# EAGLE design NMX-202 (EAGLE 8.4.3)
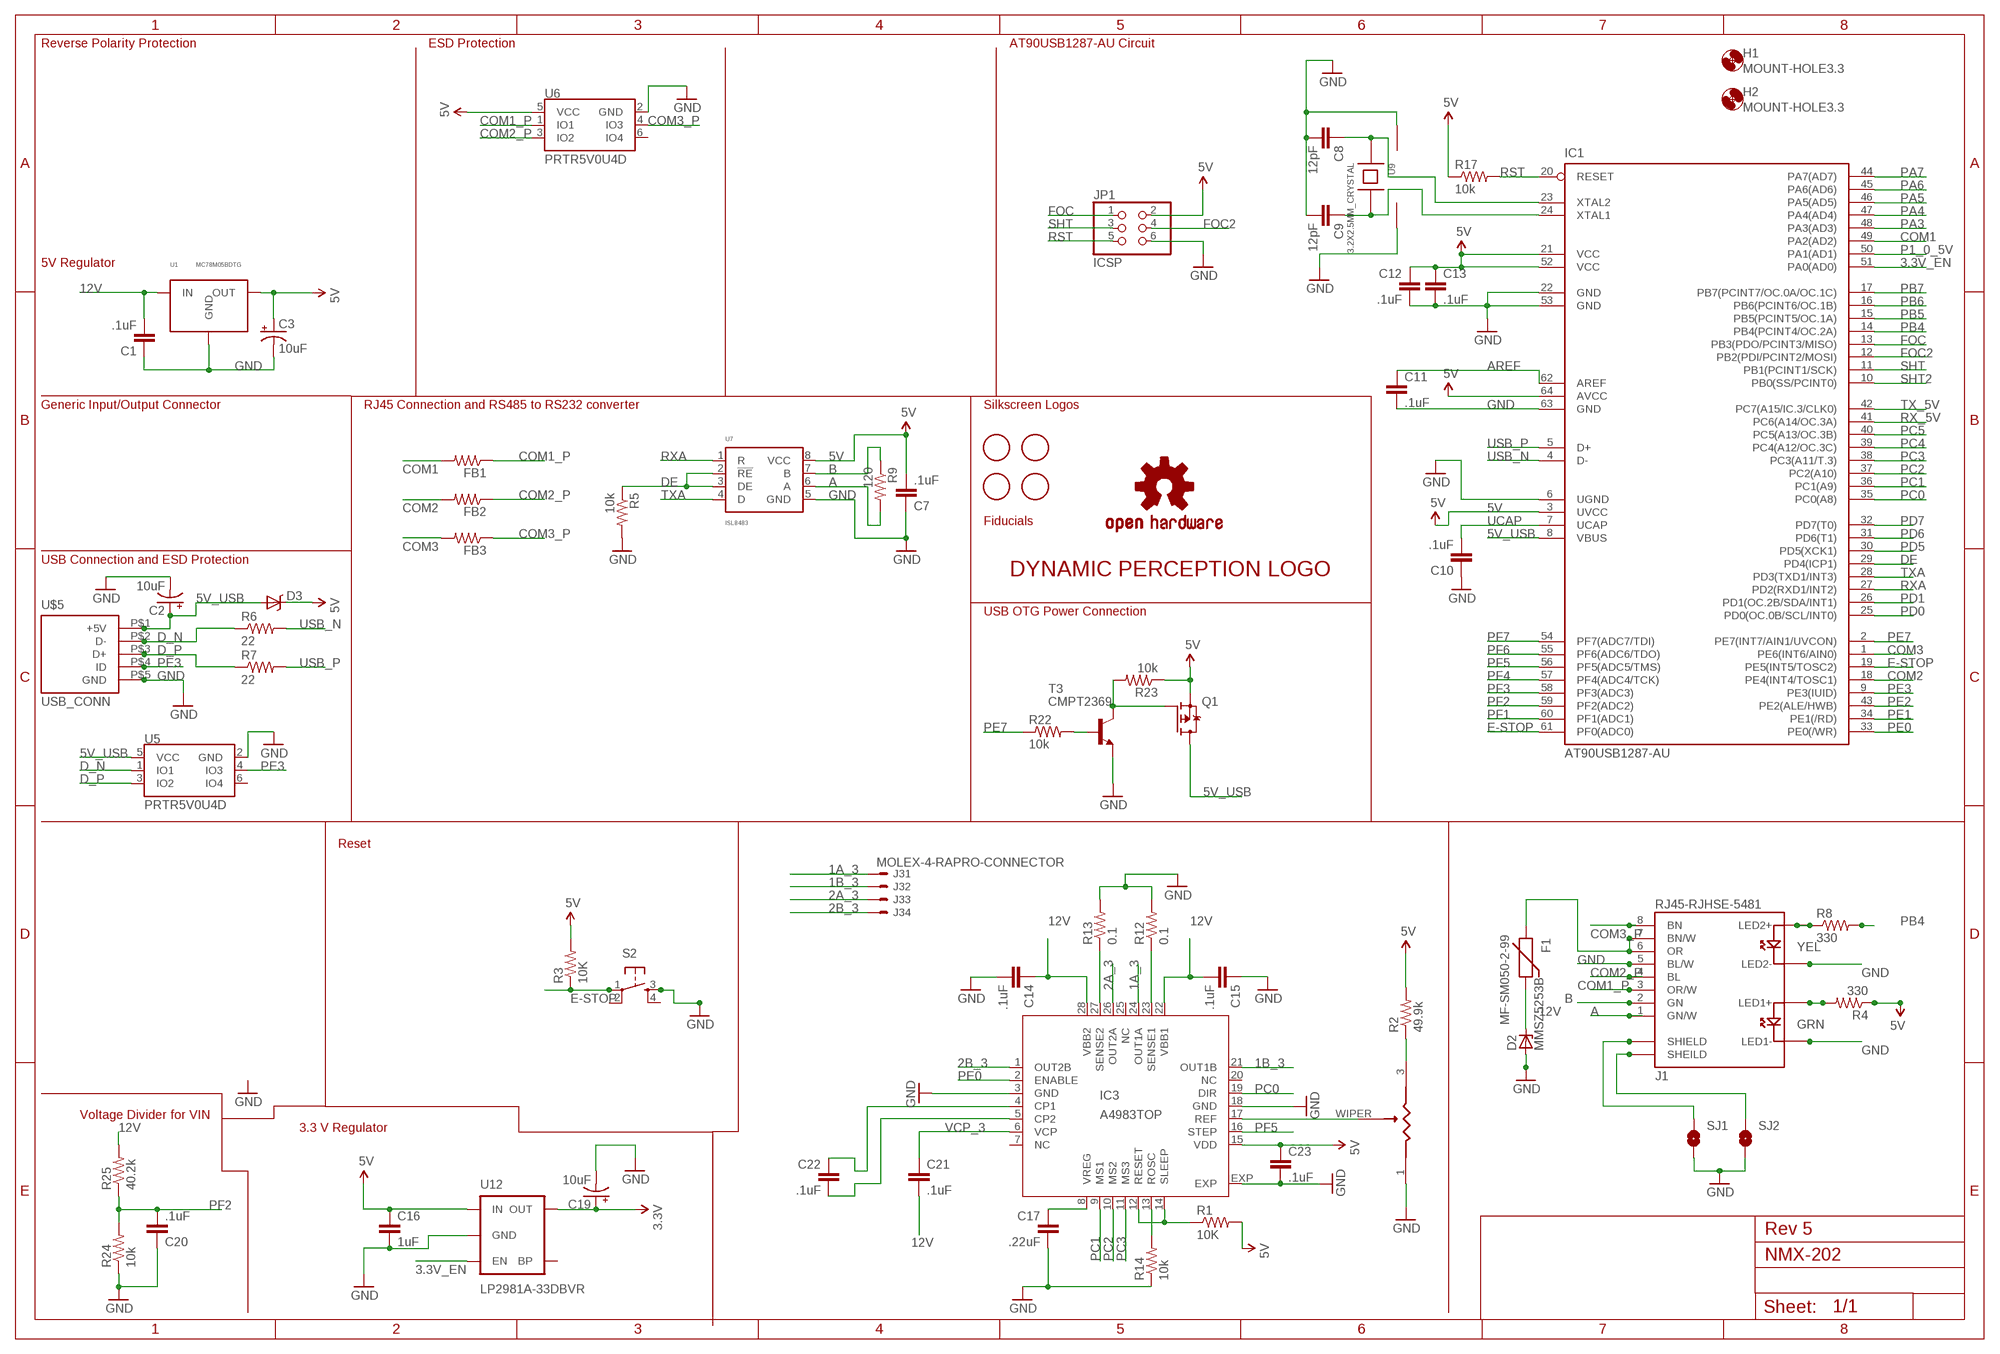
[diagram p0: schematic, sheet 1]

## Parts
C1  .1uF  CAP0402-CAP  [0402-CAP]
C2  10uF  CAP_POL1206  [EIA3216]
C3  10uF  CAP_POL1206  [EIA3216]
C7  .1uF  CAP0402-CAP  [0402-CAP]
C8  12pF  CAP0402-CAP  [0402-CAP]
C9  12pF  CAP0402-CAP  [0402-CAP]
C10  .1uF  CAP0402-CAP  [0402-CAP]
C11  .1uF  CAP0402-CAP  [0402-CAP]
C12  .1uF  CAP0402-CAP  [0402-CAP]
C13  .1uF  CAP0402-CAP  [0402-CAP]
C14  .1uF  CAP0402-CAP  [0402-CAP]
C15  .1uF  CAP0402-CAP  [0402-CAP]
C16  1uF  CAP0402-CAP  [0402-CAP]
C17  .22uF  CAP0402-CAP  [0402-CAP]
C19  10uF  CAP_POL1206  [EIA3216]
C20  .1uF  CAP0402-CAP  [0402-CAP]
C21  .1uF  CAP0402-CAP  [0402-CAP]
C22  .1uF  CAP0402-CAP  [0402-CAP]
C23  .1uF  CAP0402-CAP  [0402-CAP]
D2  MMSZ5253B  ZENER-DIODESOD123  [SOD123]
D3  DIODE-SCHOTTKY-BAT20J  [SOD-323]
F1  MF-SM050-2-99  PTC2920  [PTC-2920]
FB1  HZ0402B102R-10  R-US_R0402  [R0402]
FB2  HZ0402B102R-10  R-US_R0402  [R0402]
FB3  HZ0402B102R-10  R-US_R0402  [R0402]
FRAME2  A3L-LOCSILK_SCREEN  [DRAWING_NAME]
H1  MOUNT-HOLE3.3  [3,3]
H2  MOUNT-HOLE3.3  [3,3]
IC1  AT90USB1287-AU  [TQFP64]
IC3  A4983TOP  [QFN28ET]
J1  RJ45-RJHSE-5481  [RJ45-RJHSE]
J3  MOLEX-4-RAPRO-CONNECTOR  [PRO_CONNECTOR]
JP1  ICSP  PINHD-2X3  [2X03]
Q1  P-CHANNEL_MOSFET  [SOT23-3]
R1  10K  R-US_R0402_B  [R0402_BOTTOM]
R2  49.9k  R-US_R0402_B  [R0402_BOTTOM]
R3  10K  R-US_R0402_B  [R0402_BOTTOM]
R4  330  R-US_R0402  [R0402]
R5  10k  R-US_R0402  [R0402]
R6  22  R-US_R0402  [R0402]
R7  22  R-US_R0402  [R0402]
R8  330  R-US_R0402  [R0402]
R9  120  R-US_R0402  [R0402]
R12  0.1  R-US_R0603  [R0603]
R13  0.1  R-US_R0603  [R0603]
R14  10k  R-US_R0402_B  [R0402_BOTTOM]
R17  10k  R-US_R0402  [R0402]
R22  10k  R-US_R0402  [R0402]
R23  10k  R-US_R0402  [R0402]
R24  10k  R-US_R0402  [R0402]
R25  40.2k  R-US_R0402  [R0402]
S2  TAC_SWITCH  [TACTICLE_SWITCH_SMD_EVQP0_BOT]
SJ1  SJ_1WAY  [SJ_2]
SJ2  SJ_1WAY  [SJ_2]
T3  CMPT2369  BCW60-NPN-SOT23-BEC  [SOT23-BEC]
U1  MC78M05BDTG  VOLTAGE_REG  [DPAK-3]
U5  PRTR5V0U4D  [SOT23-6]
U6  PRTR5V0U4D  [SOT23-6]
U7  ISL8483  SN65176D  [SO-08]
U9  3.2X2.5MM_CRYSTAL  [3.2X2.5MM]
U11  CADJ  TC33X-2  [3MM_SMD]
U12  LP2981A-33DBVR  V_REG_LDOSMD  [SOT23-5]
U$1  DP_LOGOMICRO  [DP_LOGO_MICRO]
U$2  OSHW-LOGOS  [OSHW-LOGO-S]
U$3  FIDUCIAL  [FIDUCIAL_1MM]
U$4  FIDUCIAL  [FIDUCIAL_1MM]
U$5  USB_CONN  [10118194-0001LF]
U$6  FIDUCIAL  [FIDUCIAL_1MM]
U$7  FIDUCIAL  [FIDUCIAL_1MM]

## Nets
1A_3 [StepperPower]: IC3.24(OUT1A) J3.P$1
1B_3 [StepperPower]: IC3.21(OUT1B) J3.P$2
2A_3 [StepperPower]: IC3.26(OUT2A) J3.P$3
2B_3 [StepperPower]: IC3.1(OUT2B) J3.P$4
3.3V: C19.A(+) U12.5(OUT)
3.3V_EN: IC1.51(PA0(AD0)) U12.3(EN)
5V [vccControllers]: C3.A(+) C7.2 C12.1 C13.1 C16.1 C23.1 D3.C IC1.3(UVCC) IC1.21(VCC) IC1.52(VCC) IC1.64(AVCC) IC3.15(VDD) JP1.2 Q1.S R1.2 R2.2 R3.2 R4.1 R17.1 R23.1 U1.2(OUT) U6.5(VCC) U7.8(VCC) U12.1(IN)
5V_USB [vccControllers]: C2.A(+) D3.A IC1.8(VBUS) Q1.D U5.5(VCC) U$5.P$1(+5V)
12V [vccControllers]: C1.2 C14.1 C15.2 C21.2 D2.C F1.P$2 IC3.22(VBB1) IC3.28(VBB2) R25.2 U1.1(IN)
A: J1.1(GN/W) R9.2 U7.6(A)
AREF: C11.1 IC1.62(AREF)
ARST3: IC3.12(RESET) IC3.14(SLEEP) R1.1
B: J1.2(GN) R9.1 U7.7(B)
COM1: FB1.2 IC1.49(PA2(AD2))
COM1_P: FB1.1 J1.3(OR/W) U6.1(IO1)
COM2: FB2.2 IC1.18(PE4(INT4/TOSC1))
COM2_P: FB2.1 J1.4(BL) U6.3(IO2)
COM3: FB3.2 IC1.1(PE6(INT6/AIN0))
COM3_P: FB3.1 J1.8(BN) U6.4(IO3)
D_N: R6.1 U5.1(IO1) U$5.P$2(D-)
D_P: R7.1 U5.3(IO2) U$5.P$3(D+)
DE: IC1.29(PD4(ICP1)) R5.1 U7.2(!RE) U7.3(DE)
E-STOP: IC1.19(PE5(INT5/TOSC2)) IC1.61(PF0(ADC0)) R3.1 S2.1
FOC: IC1.13(PB3(PDO/PCINT3/MISO)) JP1.1
FOC2: IC1.12(PB2(PDI/PCINT2/MOSI)) JP1.4
GND [gnd]: C1.1 C2.C(-) C3.C(-) C7.1 C8.2 C9.2 C10.1 C11.2 C12.2 C13.2 C14.2 C15.1 C16.2 C17.2 C19.C(-) C20.1 C23.2 D2.A IC1.6(UGND) IC1.22(GND) IC1.53(GND) IC1.63(GND) IC3.3(GND) IC3.18(GND) IC3.EXP J1.5(BL/W) J1.LE1D-(LED1-) J1.LED2- JP1.6 R5.2 R12.2 R13.2 R14.1 R24.1 S2.3 SJ1.2 SJ2.2 T3.E U1.4(GND) U5.2(GND) U6.2(GND) U7.5(GND) U9.2(GND) U9.4 U11.1 U12.2(GND) U$5.P$5(GND)
N$1 [vcc]: F1.P$1 J1.6(OR) J1.7(BN/W)
N$2: R22.2 T3.B
N$3: C22.2 IC3.5(CP2)
N$6: IC3.17(REF) U11.WIPER
N$7: C22.1 IC3.4(CP1)
N$8: J1.LED1+ R4.2
N$9 [vcc]: IC3.23(SENSE1) R12.1
N$10 [vcc]: IC3.27(SENSE2) R13.1
N$11: J1.SHIELD@0(SHIELD) SJ1.1
N$12: J1.SHEILD@1(SHEILD) SJ2.1
N$13: Q1.G R23.2 T3.C
N$14: J1.LED2+ R8.1
N$16: R2.1 U11.3
P1_0_5V: IC1.50(PA1(AD1))
PA3: IC1.48(PA3(AD3))
PA4: IC1.47(PA4(AD4))
PA5: IC1.46(PA5(AD5))
PA6: IC1.45(PA6(AD6))
PA7: IC1.44(PA7(AD7))
PB4: IC1.14(PB4(PCINT4/OC.2A)) R8.2
PB5: IC1.15(PB5(PCINT5/OC.1A))
PB6: IC1.16(PB6(PCINT6/OC.1B))
PB7: IC1.17(PB7(PCINT7/OC.0A/OC.1C))
PC0: IC1.35(PC0(A8)) IC3.19(DIR)
PC1: IC1.36(PC1(A9)) IC3.9(MS1)
PC2: IC1.37(PC2(A10)) IC3.10(MS2)
PC3: IC1.38(PC3(A11/T.3)) IC3.11(MS3)
PC4: IC1.39(PC4(A12/OC.3C))
PC5: IC1.40(PC5(A13/OC.3B))
PD0: IC1.25(PD0(OC.0B/SCL/INT0))
PD1: IC1.26(PD1(OC.2B/SDA/INT1))
PD5: IC1.30(PD5(XCK1))
PD6: IC1.31(PD6(T1))
PD7: IC1.32(PD7(T0))
PE0: IC1.33(PE0(/WR)) IC3.2(ENABLE)
PE1: IC1.34(PE1(/RD))
PE2: IC1.43(PE2(ALE/HWB))
PE3: IC1.9(PE3(IUID)) U5.4(IO3) U$5.P$4(ID)
PE7: IC1.2(PE7(INT7/AIN1/UVCON)) R22.1
PF1: IC1.60(PF1(ADC1))
PF2: C20.2 IC1.59(PF2(ADC2)) R24.2 R25.1
PF3: IC1.58(PF3(ADC3))
PF4: IC1.57(PF4(ADC4/TCK))
PF5: IC1.56(PF5(ADC5/TMS)) IC3.16(STEP)
PF6: IC1.55(PF6(ADC6/TDO))
PF7: IC1.54(PF7(ADC7/TDI))
ROSC3: IC3.13(ROSC) R14.2
RST: IC1.20(RESET) JP1.5 R17.2
RX_5V: IC1.41(PC6(A14/OC.3A))
RXA: IC1.27(PD2(RXD1/INT2)) U7.1(R)
SHT: IC1.11(PB1(PCINT1/SCK)) JP1.3
SHT2: IC1.10(PB0(SS/PCINT0))
TX_5V: IC1.42(PC7(A15/IC.3/CLK0))
TXA: IC1.28(PD3(TXD1/INT3)) U7.4(D)
UCAP: C10.2 IC1.7(UCAP)
USB_N: IC1.4(D-) R6.2
USB_P: IC1.5(D+) R7.2
VCP_3: C21.1 IC3.6(VCP)
VREG3: C17.1 IC3.8(VREG)
XTAL1: C9.1 IC1.24(XTAL1) U9.3
XTAL2: C8.1 IC1.23(XTAL2) U9.1
Unconnected: IC3.7(NC) IC3.20(NC) IC3.25(NC) S2.2 S2.4 U5.6(IO4) U6.6(IO4) U12.4(BP)

## Notes on the sheet
- Reverse Polarity Protection | ESD Protection | AT90USB1287-AU Circuit
- 5V Regulator
- Generic Input/Output Connector | RJ45 Connection and RS485 to RS232 converter | Silkscreen Logos
- Fiducials
- USB Connection and ESD Protection
- USB OTG Power Connection
- Reset
- Voltage Divider for VIN
- 3.3 V Regulator
- Rev 5

## Library data of the parts
C1 C7 C10-C15 C20-C23 = SparkFun-Capacitors:CAP: Capacitor Standard 0603 ceramic capacitor, and 0.1" leaded capacitor.; MF: Taiyo Yuden; MPN: TMK105BJ104KV-F
C2 C3 C19 = SparkFun-Capacitors:CAP_POL: Capacitor Polarized These are standard SMD and PTH capacitors. Normally 10uF, 47uF, and 100uF in electrolytic and tantalum varieties. Always verify the external diameter of the through hole cap, it varies with capacity, voltage, and manufacturer. The EIA devices should be standard.; MF: Kemet; MPN: T491A106M016AT
C8 C9 = SparkFun-Capacitors:CAP: Capacitor Standard 0603 ceramic capacitor, and 0.1" leaded capacitor.; MF: TDK Corporation; MPN: C1005C0G1H120J050BA
C16 = SparkFun-Capacitors:CAP: Capacitor Standard 0603 ceramic capacitor, and 0.1" leaded capacitor.; MF: TDK Corporation; MPN: C1005X5R1C105K050BC
C17 = SparkFun-Capacitors:CAP: Capacitor Standard 0603 ceramic capacitor, and 0.1" leaded capacitor.; MF: Taiyo Yuden; MPN: TMK105BJ224KVHF
D2 = diode:ZENER-DIODE: Z-Diode; MF: Fairchild Semiconductor; MPN: MMSZ5253B
D3 = SparkFun-DiscreteSemi:DIODE-SCHOTTKY: Schottky diodes in SFE's production catalog BAT20J 1A 23V 0.62Vf RB751 120mA 40V 0.37Vf PMEG4005EJ 0.5A 40V 0.42Vf MBRA140 1A 40V 0.5Vf B340A 3A 40V SMA; MF: NXP Semiconductors; MPN: PMEG3010BEA,115; PROD_ID: DIO-11623; VALUE: BAT20J
F1 = SparkFun-PowerIC:PTC: Resettable Fuse PTC Resettable Fuse. Spark Fun Electronics SKU : COM-08357; MF: Bel Fuse; MPN: 0ZCD0050FF2C
FB1-FB3 = resistor:R-US_: RESISTOR, American symbol; MF: Laird-Signal Integrity Products; MPN: HZ0402B102R-10
FRAME2 = frames:A3L-LOC: FRAME DIN A3, landscape with location and doc. field
H1 H2 = holes:MOUNT-HOLE: MOUNTING HOLE with drill center marker
IC1 = at90usb:AT90USB1287-*: Atmel AT90USB1287 AVR Microcontroller with USB Interface and 128kB Flash Memory; MF: Atmel; MPN: AT90USB1287-AU
IC3 = allegro:A4983: DMOS Microstepping Driver with Translator Auto generated by make-symbol-device-package-bsdl.ulp Rev. 32 Source: http://www.allegromicro.com/en/Products/Part_Numbers/4983/4983.pdf; MPN: A4983SETTR-T; OC_FARNELL: 1688956; OC_NEWARK: 39M6763
J1 = LoganSmith-Connectors:RJ45-RJHSE-548*: Shielded CAT5 RJ45 90° w/ LEDs and board lock Datasheet <https://www.amphenolcanada.com/ProductSearch/drawings/AC/RJHSE548X.pdf>; LED1_COLOR: GRN; LED2_COLOR: YEL
J3 = NMX_StepperSide_V1-2:MOLEX-4-RA; MF: Molex Inc; MPN: 0022053041
JP1 = pinhead:PINHD-2X3: PIN HEADER; MF: FCI; MPN: 67996-406HLF
Q1 = QS_Components:P-CHANNEL_MOSFET; MF: Fairchild Semiconductor; MPN: FDV304P
R1 R3 R5 R17 R22-R24 = resistor:R-US_: RESISTOR, American symbol; MF: Yageo; MPN: RC0402FR-0710KL
R2 = resistor:R-US_: RESISTOR, American symbol; MF: Yageo; MPN: RC0402FR-0749K9L
R4 R8 = resistor:R-US_: RESISTOR, American symbol; MF: Yageo; MPN: RC0402FR-07330RL
R6 R7 = resistor:R-US_: RESISTOR, American symbol; MF: Yageo; MPN: RC0402JR-0722RL
R9 = resistor:R-US_: RESISTOR, American symbol; MF: Yageo; MPN: RC0402JR-07120RL
R12 R13 = resistor:R-US_: RESISTOR, American symbol; MF: Samsung Electro-Mechanics America; MPN: RU1608FR100CS
R14 = resistor:R-US_: RESISTOR, American symbol; MF: Yageo; MPN: RC0402FR-0720KL
R25 = resistor:R-US_: RESISTOR, American symbol; MF: Yageo; MPN: RC0402FR-0740K2L
S2 = SparkFun-Electromechanical:TAC_SWITCH: Momentary Switch Button commonly used for reset or general input. Spark Fun Electronics SKU : COM-00097 SMT- SWCH-08247; MF: Panasonic Electronic Components; MPN: EVQ-P0Q02Q
SJ1 SJ2 = LoganSmith-Connectors:SJ_1WAY: 1-way solder jumper
T3 = transistor:*-NPN-: NPN Transistror BF959 corrected 2008.03.06; MF: Fairchild Semiconductor; MPN: BC847BMTF
U1 = QS_Components:VOLTAGE_REG; MF: ON Semiconductor; MPN: MC78M05BDTRKG
U5 U6 = QS_Components:PRTR5V0U4D; MF: NXP Semiconductors; MPN: PRTR5V0U4D
U7 = texas:SN65176: DIFFERENTIAL BUS TRANSCEIVER Source: http://focus.ti.com .. sn65176b.pdf; MF: TEXAS INSTRUMENTS; MPN: SN65176BD; OC_FARNELL: 9589970; OC_NEWARK: 08F5891
U9 = QS_Components:3.2X2.5MM_CRYSTAL; MF: AVX Corp/Kyocera Corp; MPN: CX3225SB16000E0FPZ25
U11 = QS_Components:TC33X-2; MF: Bourns Inc; MPN: TC33X-2-103E
U12 = SparkFun-PowerIC:V_REG_LDO: Voltage Regulator LDO Standard 150mA LDO voltage regulator in SOT-23 layout. Micrel part MIC5205. BP (by-pass) pin is used to lower output noise with 470pF cap.; MF: Texas Instruments; MPN: LP2981A-33DBVR
U$1 = QS_Components:DP_LOGO
U$2 = SparkFun-Aesthetics:OSHW-LOGO: Open Source Hardware Logo This logo indicates the piece of hardware it is found on incorporates a OSHW license and/or adheres to the definition of open source hardware found here: http://freedomdefined.org/OSHW
U$3 U$4 U$6 U$7 = adafruit:FIDUCIAL: For use by pick and place machines to calibrate the vision/machine, 1mm By microbuilder.eu
U$5 = dynamic_perception:USB_CONN

## Net classes
0 default: width 0.152 mm
1 vcc: width 0.635 mm, drill 0.254 mm, clearance 0.152 mm
2 gnd: width 0.152 mm, drill 0.254 mm, clearance 0.152 mm
3 vccControllers: width 0.152 mm, drill 0.254 mm, clearance 0.152 mm
4 StepperPower: width 0.61 mm, drill 0.254 mm, clearance 0.152 mm

## Board
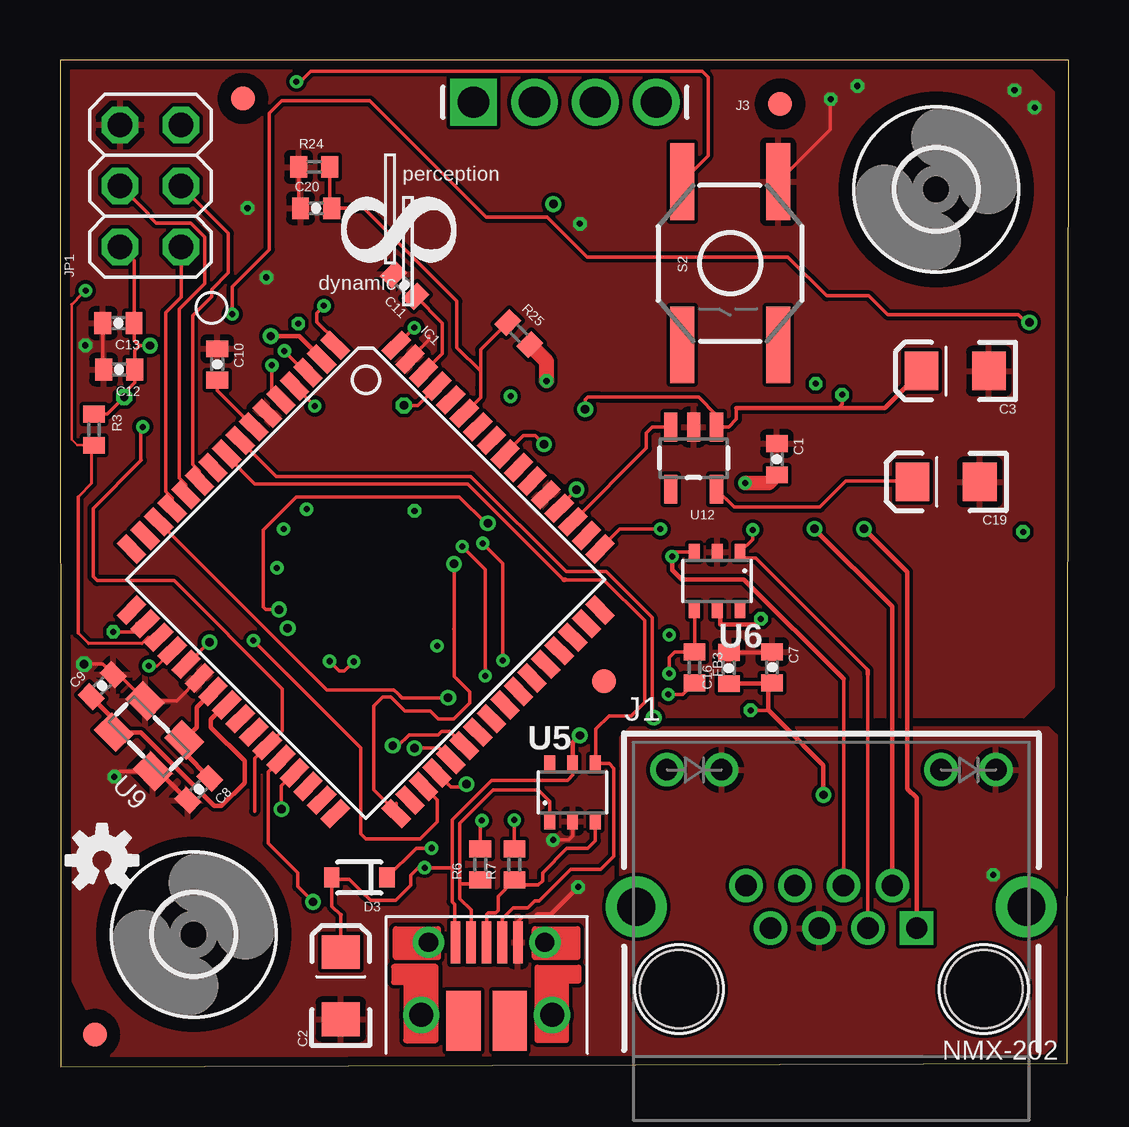
[diagram p1: board, top side]
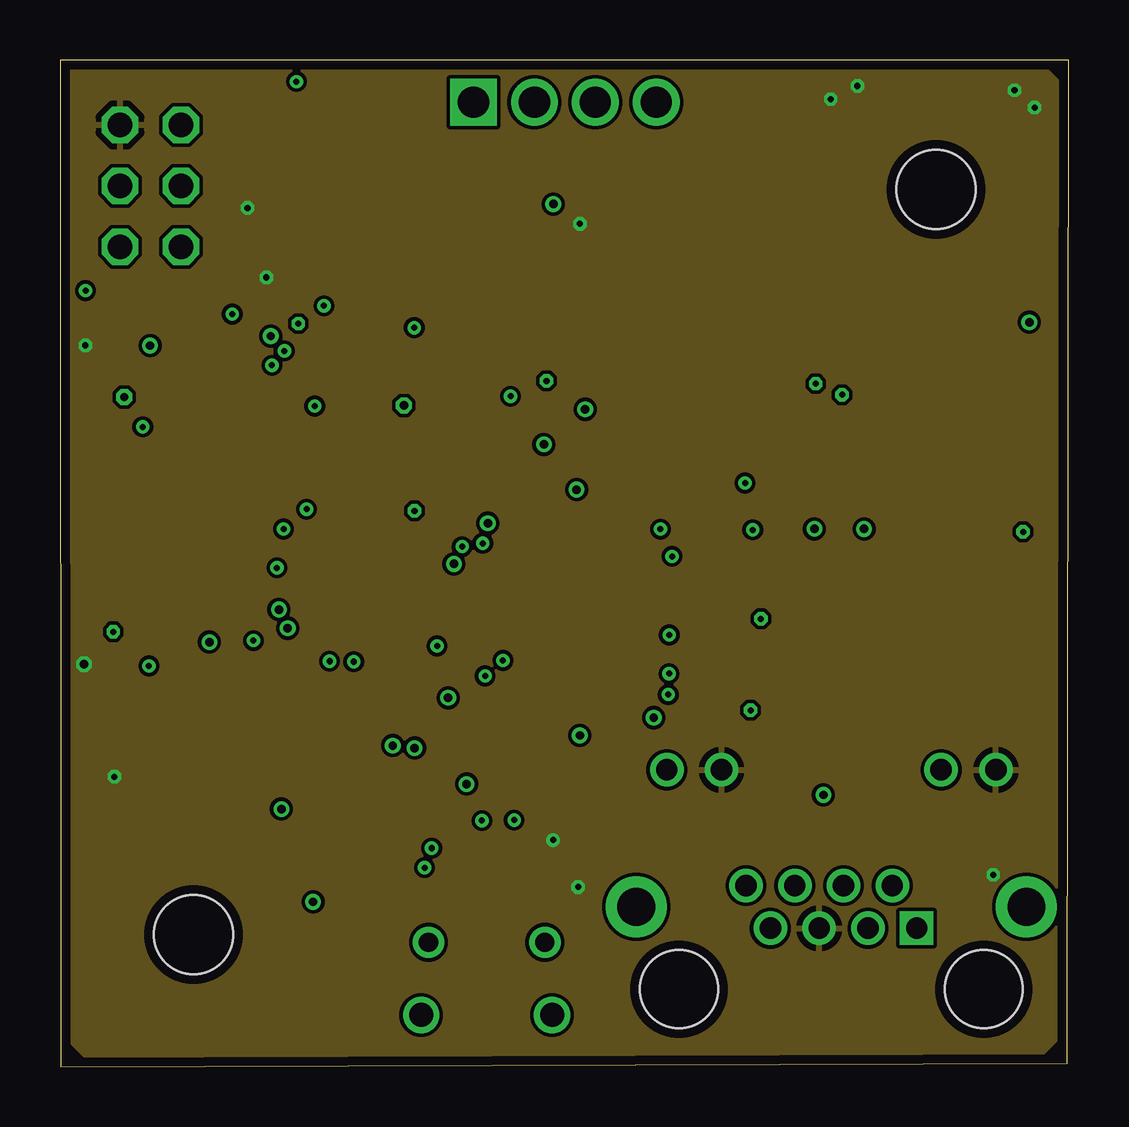
[diagram p2: board, inner layer GND]
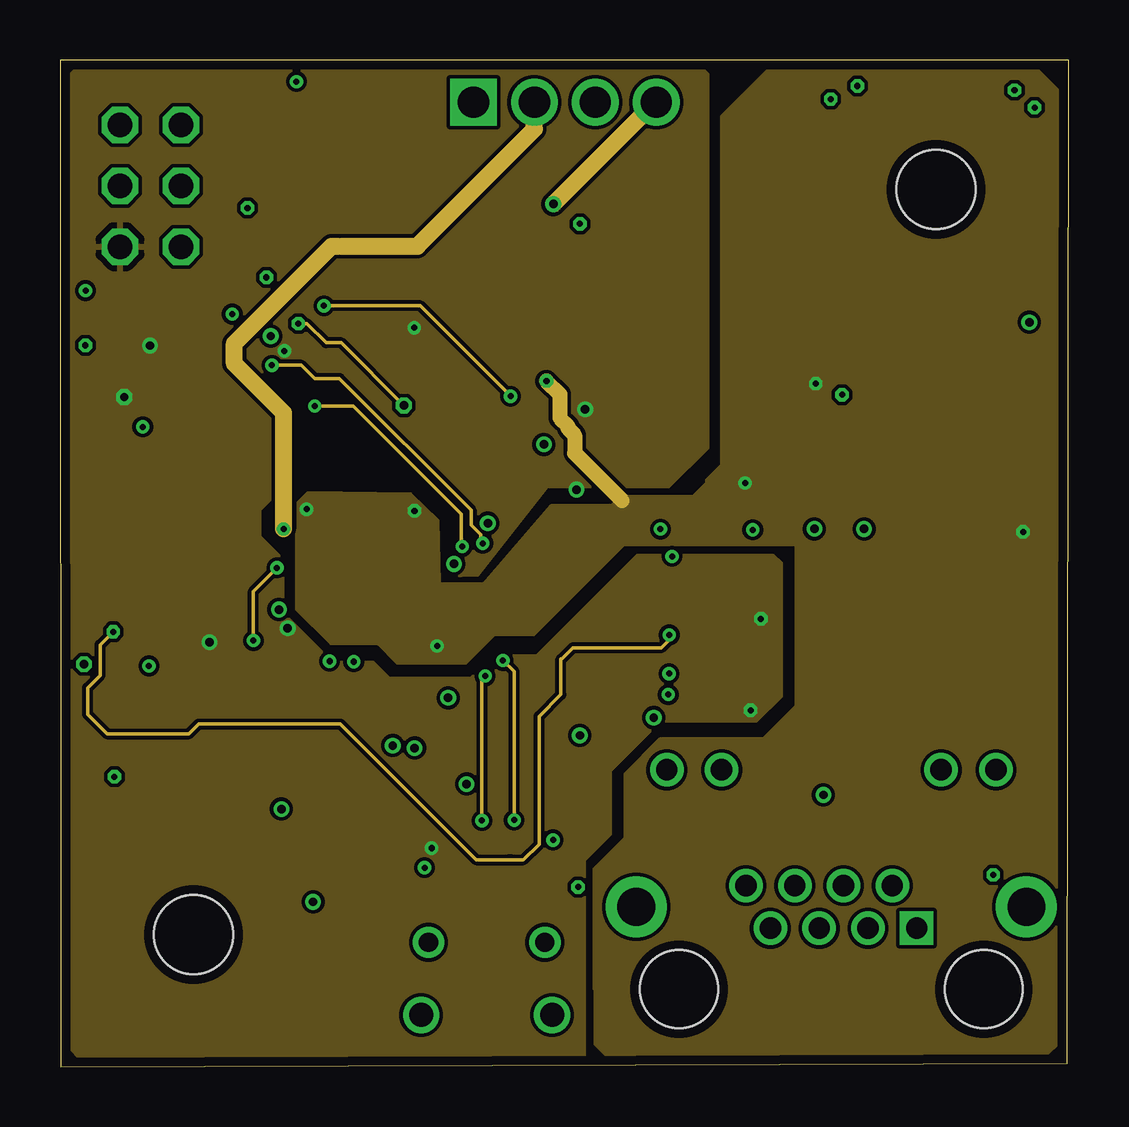
[diagram p3: board, inner layer POWER]
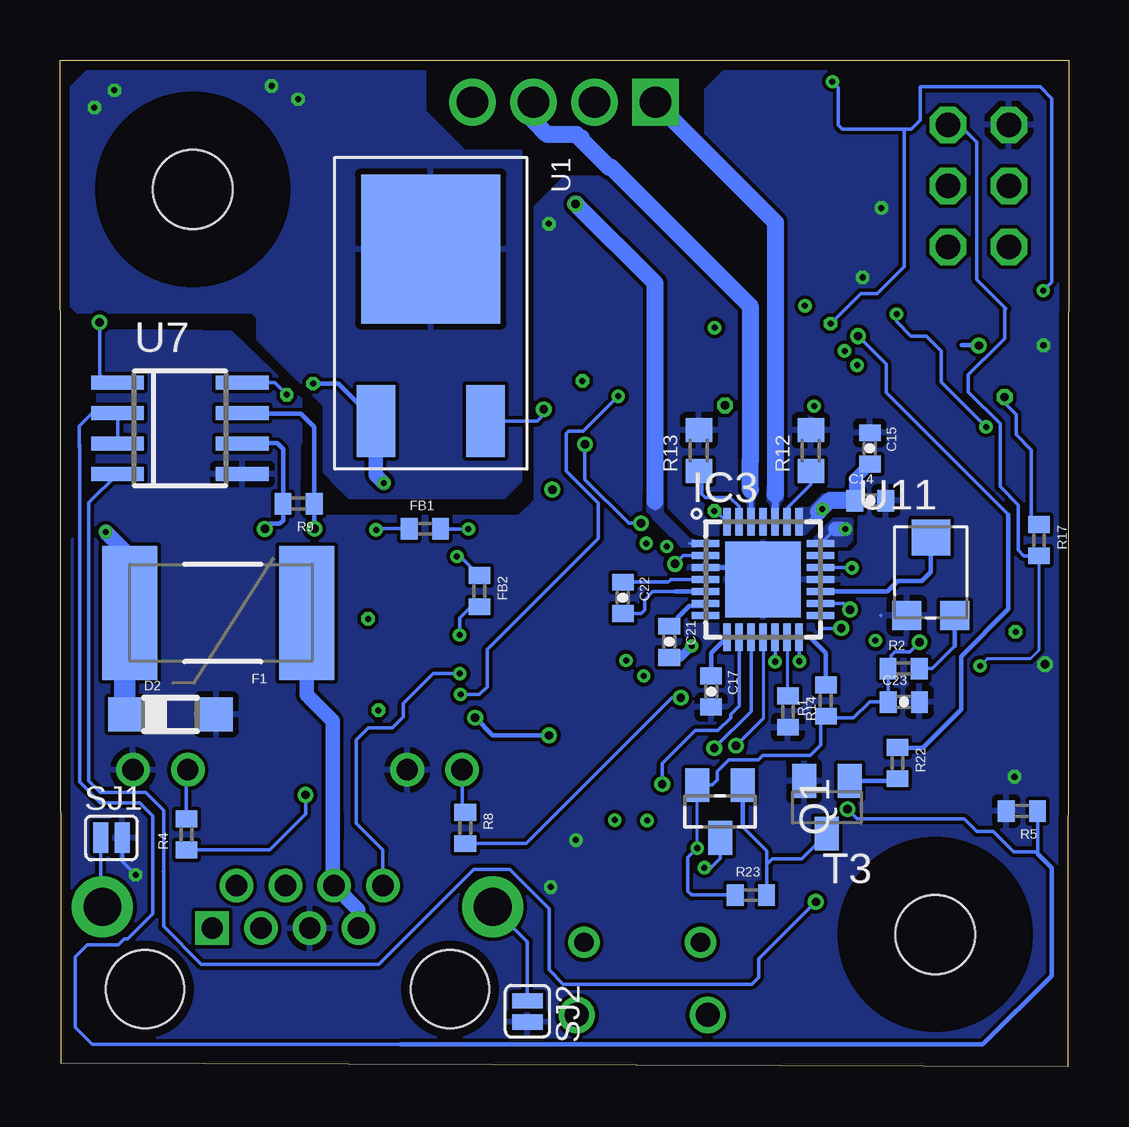
[diagram p4: board, bottom side, seen from below]

Size 42.04 x 41.98 mm. Coordinates in mm from the lower left corner, seen from the top.
Outline: 0.04,0 41.98,0.15 42.04,41.98 0,41.98 0.04,0
Copper layers (1+2*15+16): Top 0.035mm / dielectric 0.35mm / GND 0.035mm / dielectric 0.76mm / POWER 0.035mm / dielectric 0.35mm / Bottom 0.035mm
Design rules "default *": minimum track width 0.15mm, minimum drill 0.25mm, track to track 0.15mm, track to pad 0.15mm, pad to pad 0.15mm, via to via 0.15mm, smd to smd 0mil, copper to edge 0.4mm, drill to drill 8mil, minimum pad ring 10mil, minimum via ring 6mil, stop-mask expansion 2mil, vias tented up to drill 0.5mm, thermal gap 10mil

### Footprints (pad centres in the part's own frame; a part is rotated, then mirrored left to right if it is on the bottom)
0402-CAP = smd 0.7 x 0.9: 1 -0.65,0; 2 0.65,0
EIA3216 = smd 1.4 x 1.6: A -1.4,0; C 1.4,0
SOD123 = smd 1.4 x 1.4: A 1.9,0; C -1.9,0
SOD-323 = smd 0.63 x 0.83: A 1.15,0; C -1.15,0
PTC-2920 = smd 2.286 x 5.588: P$1 -3.683,0; P$2 3.683,0
R0402 = smd 0.7 x 0.9: 1 -0.65,0; 2 0.65,0
3,3 = hole 3.3: 0,0
TQFP64 = smd 1.194 x 0.559: 1 -7.8,6; 2 -7.8,5.2; 3 -7.8,4.4; 4 -7.8,3.6; 5 -7.8,2.8; 6 -7.8,2; 7 -7.8,1.2; 8 -7.8,0.4; 9 -7.8,-0.4; 10 -7.8,-1.2; 11 -7.8,-2; 12 -7.8,-2.8; 13 -7.8,-3.6; 14 -7.8,-4.4; 15 -7.8,-5.2; 16 -7.8,-6; 33 7.8,-6; 34 7.8,-5.2; 35 7.8,-4.4; 36 7.8,-3.6; 37 7.8,-2.8; 38 7.8,-2; 39 7.8,-1.2; 40 7.8,-0.4; 41 7.8,0.4; 42 7.8,1.2; 43 7.8,2; 44 7.8,2.8; 45 7.8,3.6; 46 7.8,4.4; 47 7.8,5.2; 48 7.8,6 | smd 0.559 x 1.194: 17 -6,-7.8; 18 -5.2,-7.8; 19 -4.4,-7.8; 20 -3.6,-7.8; 21 -2.8,-7.8; 22 -2,-7.8; 23 -1.2,-7.8; 24 -0.4,-7.8; 25 0.4,-7.8; 26 1.2,-7.8; 27 2,-7.8; 28 2.8,-7.8; 29 3.6,-7.8; 30 4.4,-7.8; 31 5.2,-7.8; 32 6,-7.8; 49 6,7.8; 50 5.2,7.8; 51 4.4,7.8; 52 3.6,7.8; 53 2.8,7.8; 54 2,7.8; 55 1.2,7.8; 56 0.4,7.8; 57 -0.4,7.8; 58 -1.2,7.8; 59 -2,7.8; 60 -2.8,7.8; 61 -3.6,7.8; 62 -4.4,7.8; 63 -5.2,7.8; 64 -6,7.8
QFN28ET = smd 1.15 x 0.3: 1 -2.4,1.5; 2 -2.4,1; 3 -2.4,0.5; 4 -2.4,0; 5 -2.4,-0.5; 6 -2.4,-1; 7 -2.4,-1.5; 15 2.4,-1.5; 16 2.4,-1; 17 2.4,-0.5; 18 2.4,0; 19 2.4,0.5; 20 2.4,1; 21 2.4,1.5 | smd 0.3 x 1.15: 8 -1.5,-2.4; 9 -1,-2.4; 10 -0.5,-2.4; 11 0,-2.4; 12 0.5,-2.4; 13 1,-2.4; 14 1.5,-2.4; 22 1.5,2.4; 23 1,2.4; 24 0.5,2.4; 25 0,2.4; 26 -0.5,2.4; 27 -1,2.4; 28 -1.5,2.4 | smd 3.15 x 3.15: EXP 0,0
RJ45-RJHSE = drill 0.889 square: 1 3.556,-1.778 | drill 0.889: 2 2.54,0; 3 1.524,-1.778; 4 0.508,0; 5 -0.508,-1.778; 6 -1.524,0; 7 -2.54,-1.778; 8 -3.556,0; LE1D- 6.858,4.826; LED1+ 4.572,4.826; LED2+ -6.858,4.826; LED2- -4.572,4.826 | drill 1.575 pad 2.54: SHEILD@1 -8.128,-0.889; SHIELD@0 8.128,-0.889 | hole 3.25: -6.35,-4.318; 6.35,-4.318
PRO_CONNECTOR = drill 1.3 square: P$1 0,3.81 | drill 1.3: P$2 0,1.27; P$3 0,-1.27; P$4 0,-3.81
2X03 = drill 1.016 octagon: 1 -2.54,-1.27; 2 -2.54,1.27; 3 0,-1.27; 4 0,1.27; 5 2.54,-1.27; 6 2.54,1.27
SOT23-3 = smd 1.4 x 1: D 1.1,0; G -1.1,0.95; S -1.1,-0.95
R0402_BOTTOM = smd 0.7 x 0.9 bottom: 1 -0.65,0; 2 0.65,0
R0603 = smd 1 x 1.1: 1 -0.85,0; 2 0.85,0
TACTICLE_SWITCH_SMD_EVQP0_BOT = smd 3.2 x 1 bottom: 1 -3.4,2; 2 3.4,2; 3 -3.4,-2; 4 3.4,-2
SJ_2 = smd 0.635 x 1.27: 1 -0.889,0; 2 0,0
SOT23-BEC = smd 1 x 1.4: B -0.95,-1.1; C 0,1.1; E 0.95,-1.1
DPAK-3 = smd 3 x 1.6: 1 -4.39,2.285; 2 -4.39,-2.285 | smd 6.2 x 5.8: 4 2.79,0
SOT23-6 = smd 0.7 x 0.45: 1 -1.2,0.95; 2 -1.2,0; 3 -1.2,-0.95; 4 1.2,-0.95; 5 1.2,0; 6 1.2,0.95
SO-08 = smd 2.2 x 0.6: 1 -2.6,1.905; 2 -2.6,0.635; 3 -2.6,-0.635; 4 -2.6,-1.905; 5 2.6,-1.905; 6 2.6,-0.635; 7 2.6,0.635; 8 2.6,1.905
3.2X2.5MM = smd 1.05 x 1.3: 1 -0.925,1.15; 2 -0.925,-1.15; 3 0.925,-1.15; 4 0.925,1.15
3MM_SMD = smd 1.2 x 1.2: 1 -1.8,1; 3 -1.8,-1 | smd 1.5 x 1.6: WIPER 1.45,0
SOT23-5 = smd 1.2 x 0.55: 1 -1.3,0.95; 2 -1.3,0; 3 -1.3,-0.95; 4 1.3,-0.95; 5 1.3,0.95
FIDUCIAL_1MM = smd 1 x 1: 1 0,0
10118194-0001LF = smd 0.4 x 1.75: P$1 -1.3,3.03; P$2 -0.65,3.03; P$3 0,3.03; P$4 0.65,3.03; P$5 1.3,3.03 | drill 0.8 pad 1.2: P$6 -2.425,3.03; P$7 2.425,3.03 | drill 1 pad 1.4: P$8 2.725,0; P$9 -2.725,0 | smd 1.425 x 2.5: P$10 0.963,-0.25; P$11 -0.963,-0.25

### Placement (x,y rotation side)
C1  29.87,25.34 270 top
C2  11.7,3.39 270 top
C3  37.3,29.01 0 top
C7  29.67,16.65 270 top
C8  5.79,11.57 225 top
C9  1.76,15.89 45 top
C10  6.55,29.29 270 top
C11  14.35,32.58 135 top
C12  2.47,29.07 180 top
C13  2.44,31.01 180 top
C14  8.28,23.61 0 bottom
C15  8.29,25.79 270 bottom
C16  27.87,16.63 90 top
C17  14.91,15.65 270 bottom
C19  36.92,24.39 0 top
C20  10.67,35.79 0 top
C21  16.65,17.72 270 bottom
C22  18.58,19.56 270 bottom
C23  6.88,15.21 0 bottom
D2  37.43,14.7 0 bottom
D3  12.47,7.9 180 top
F1  35.44,18.93 180 bottom
FB1  26.83,22.44 0 bottom
FB2  24.57,19.84 270 bottom
FB3  26.44,16.66 270 top
FRAME2  36.75,0.31 0 top
H1  36.51,36.58 0 top
H2  5.57,5.52 0 top
IC1  12.74,20.32 315 top
IC3  12.74,20.32 0 bottom
J1  32.14,7.56 0 top
J3  21.04,40.21 90 top
JP1  3.77,36.73 90 top
Q1  14.54,10.65 270 bottom
R1  10.13,15.27 270 top
R2  6.88,16.61 0 top
R3  1.41,26.57 90 bottom
R4  36.77,9.7 90 bottom
R5  1.96,10.67 180 bottom
R6  17.51,8.45 90 top
R7  18.93,8.45 90 top
R8  25.15,9.96 270 bottom
R9  32.09,23.48 180 bottom
R12  10.75,25.69 90 bottom
R13  15.42,25.7 90 bottom
R14  11.71,14.81 90 top
R17  1.24,21.96 270 bottom
R22  7.14,12.67 270 bottom
R23  13.25,7.17 0 bottom
R24  10.59,37.52 0 top
R25  19.12,30.57 315 top
S2  27.92,33.51 270 bottom
SJ1  39.45,9.55 0 bottom
SJ2  22.56,1.87 270 bottom
T3  10.08,10.83 180 bottom
U1  26.59,31.31 90 bottom
U5  21.36,11.44 90 top
U6  27.38,20.26 270 top
U7  37.04,26.62 0 bottom
U9  3.7,13.8 225 top
U11  5.75,20.62 90 bottom
U12  26.4,25.38 270 top
U$1  14.05,34.77 0 top
U$2  1.75,8.62 0 top
U$3  30,40.14 0 top
U$4  1.45,1.36 0 top
U$5  17.78,2.17 0 top
U$6  22.67,16.09 0 top
U$7  7.62,40.37 0 top

### Tracks (layer width: path | path; a pad name or v marks a point on that pad's centre or on a via)
1A_3
  Bottom 0.152: 12.23,25.26 12.23,22.98 12.24,22.96 IC3.24
  Bottom 0.305: 12.23,22.98 12.23,23.88
  Bottom 0.711: J3.P$1 12.23,35.21 12.23,25.26 | 12.23,25.26 12.23,24.7 | 12.23,25.28 12.23,25.26 | 12.23,25.26 12.23,23.88 12.24,23.87
  pour Bottom: 11.97,24.11 11.97,23.71 12.07,23.61 12.07,23.25 12.15,23.17 12.16,23.16 12.34,23.16 12.35,23.17 12.35,23.56 12.51,23.71 12.51,23.73 12.51,24.12 12.43,24.19 12.04,24.19 11.97,24.13
  pour Bottom (no thermals): 11.94,24.16 11.94,23.64 12.07,23.5 12.07,23.3 12.17,23.21 12.19,23.19 12.37,23.19 12.39,23.22 12.39,23.45 12.55,23.6 12.55,24.17 12.53,24.19 11.96,24.19
1B_3  (via drill 0.25)
  POWER 0.15: 11.57,34.21 11.76,34.21
  POWER 0.711: 11.57,34.21 11.32,34.21 7.27,30.16 7.27,29.31 9.32,27.26 v9.32,22.43 | 11.76,34.21 14.89,34.21 19.77,39.09 J3.P$2
  Bottom 0.152: 9.74,22.43 IC3.21
  Bottom 0.61: v9.32,22.43 9.74,22.43
  pour Bottom (no thermals): 9.04,22.65 9.04,21.98 9.2,21.81 9.28,21.73 10.56,21.73 10.59,21.76 10.59,22.03 9.79,22.83 9.09,22.83 9.03,22.78 9.03,22.69
2A_3
  Bottom 0.152: 13.24,24.02 13.28,24.05
  Bottom 0.203: IC3.26 13.24,24.02
  Bottom 0.711: J3.P$3 22.31,39.45 21.73,38.87 20.52,38.87 | 20.52,38.87 20.38,38.73 20.32,38.73 | 13.28,25.27 | 13.28,25.27 13.28,31.72 19.05,37.49 19.15,37.49 20.52,38.87 | 13.28,25.27 13.28,24.05
  pour Bottom (no thermals): 13.02,24.31 13.02,23.81 13.1,23.74 13.1,23.32 13.14,23.29 13.15,23.27 13.35,23.27 13.38,23.3 13.38,23.7 13.49,23.81 13.49,24.34 13.49,24.34 13.03,24.34
2B_3  (via drill 0.35)
  POWER 0.711: v20.56,35.97 24.8,40.21 J3.P$4
  Bottom 0.102: 15.48,21.82 IC3.1 15.82,21.82 | 17.24,23.24 17.24,23.58
  Bottom 0.711: 17.24,23.58 17.24,32.67 v20.54,35.97 v20.56,35.97
  pour Bottom (no thermals): 15.56,21.86 15.66,21.97 15.79,21.97 16.93,23.11 16.93,23.61 17.07,23.75 17.54,23.75 17.56,23.73 17.56,23.48 17.56,23.1 17.24,22.78 16.17,21.71 15.55,21.71 15.55,21.85
3.3V
  Top 0.152: U12.5 28.09,23.34 31.66,23.34 32.75,24.42 36.03,24.42 36,24.39 C19.A
3.3V_EN
  Top 0.152: IC1.51 24.44,25.79 24.44,26.43 24.68,26.68 U12.3
5V  (via drill 0.25, 0.35)
  Top 0.127: v14.75,30.82 v14.76,30.82 | 3.1,30.99 C13.1
  Top 0.15: 3.12,28.54
  Top 0.152: D3.C 14.85,9.12 v15.49,9.12 | IC1.3 10.25,28.95 v9.35,29.85 | IC1.64 v14.75,30.82 | 3.1,30.99 3.1,30.29 3.32,30.07 | IC1.52 20.8,23.35 v21.52,24.07 | IC1.21 5.3,16.78 v6.22,17.71 | C13.1 3.09,33.6 JP1.2 | R3.2 1.97,27.21 v2.68,27.93 2.68,28.1 3.12,28.54 | v28.77,14.87 29.52,14.87 30.12,14.27 | v32.59,28.02 32.59,27.63 32.42,27.47 | 3.32,30.07 v3.75,30.07 | 3.32,30.07 3.12,29.87 C12.1 3.12,28.54 | v21.88,27.41 21.88,27.81 21.98,27.91 22.51,27.91 22.52,27.92 26.61,27.92 27.35,27.18 U12.1 27.86,26.68 28.18,27 28.18,27.47
  Top 0.178: C3.A 34.36,27.47 32.42,27.47 28.18,27.47 | v31.81,11.34 31.81,12.58 30.12,14.27 29.51,14.88 29.51,15.85 | 29.51,15.85 29.51,15.88 | U6.5 27.51,18.93 27.51,18.44 28.76,18.44 | 28.76,18.44 28.96,18.44 v29.2,18.68 | 28.71,18.39 28.76,18.44 | 29.51,15.85 C7.2 29.65,15.98 C16.1
  POWER 0.152: v9.49,18.29 | v9.49,18.29 9.43,18.35
  Bottom 0.127: v15.49,9.12 Q1.S
  Bottom 0.152: v15.49,9.12 15.87,8.74 15.87,7.33 15.71,7.17 R23.1 | U1.2 22.15,26.92 21.88,27.19 v21.88,27.41 | 7.53,15.22 R2.2 7.53,16.93 7.4,17.06 7.4,17.16 7.25,17.31 6.63,17.31 v6.22,17.71 | 7.53,15.22 C23.1 | IC3.15 10.34,18.38 10.25,18.29 v9.49,18.29 | R4.1 33.3,9.05 31.81,10.54 v31.81,11.34 | 7.53,15.22 8.3,15.22 8.98,14.54 10.05,14.54 R1.2 10.35,14.4 10.35,13.42 10.78,12.99 12.75,12.99 12.95,12.79 14.18,12.79 14.65,12.33 14.65,11.97 14.87,11.75 Q1.S | R17.1 1.56,22.93 1.56,25.72 2.2,26.36 2.2,27.2 2.68,27.68 v2.68,27.93 | U7.8 33.09,28.53 v32.59,28.02
  Bottom 0.178: v3.75,30.07 3.77,30.09 4.46,30.09 | 9.42,29.92 v9.35,29.85
  pour POWER: 0.71,41.63 26.74,41.63 26.98,41.39 26.98,25.8 25.37,24.19 20.29,24.19 17.4,20.51 16.1,20.48 16.28,22.75 15.67,24.35 14.21,24.5 9.61,24.5 8.33,23.22 8.33,22.12 9.29,21.16 9.29,18.92 11.34,16.87 13.04,16.87 13.71,16.2 17.12,16.2 18.05,17.13 19.86,17.13 24.05,21.32 29.72,21.32 30.04,21 30.04,15.46 29.02,14.43 25.02,14.43 22.92,12.33 22.92,9.7 21.84,8.62 21.84,0.37 21.73,0.27 0.93,0.27 0.32,0.88 0.32,41.25 0.7,41.63
5V_USB  (via drill 0.25, 0.35)
  Top 0.15: 16.33,8.31 16.34,8.3
  Top 0.152: 16.45,5.23 16.45,6.78 16.34,6.88 16.34,8.3 16.34,10.3 17.99,11.96 21.15,11.96 21.36,12.17 U5.5 | 16.33,8.31 v15.19,8.31 14.93,8.31 14.62,8 14.62,7.57 13.99,6.93 12.95,6.93 12.58,7.31 12.56,7.31 12.06,7.82 11.41,7.82 D3.A 11.43,7.9 11.33,7.8 11.33,6.71 11.69,6.35 | v24.74,14.56 24.68,14.62 24.68,18.73 22.76,20.65 21.09,20.65 17.12,24.62 9.01,24.62 IC1.8 | 11.7,6.34 C2.A
  Top 0.178: 16.45,5.23 U$5.P$1 | v21.66,13.82 21.36,13.52 U5.5 | 11.69,6.35 11.7,6.34
  Bottom 0.15: Q1.D 14.54,8.7 14.93,8.31 v15.19,8.31
  Bottom 0.178: v24.74,14.56 24,13.82 v21.66,13.82
12V  (via drill 0.25)
  Top 0.61: C1.2 29.53,24.34 v28.55,24.34
  Top 0.635: R25.2 20.27,29.42 v20.27,28.6
  POWER 0.178: v31.49,28.49 v31.5,28.49
  POWER 0.508: 21.17,26.71 21.17,26.61 | 23.42,23.61 23.42,23.59
  POWER 0.635: v20.27,28.6 20.83,28.04 20.83,27.05 21.17,26.71 | 21.17,26.61 21.45,26.34 21.45,25.59 23.42,23.61
  Bottom 0.15: 16.19,17.07 C21.2
  Bottom 0.152: F1.P$2 39.13,19.3 39.13,21.3 | v14.77,23.18 14.7,23.18 IC3.28 | IC3.22 10.87,22.72 10.44,23.15 10.34,23.25 v10.27,23.25
  Bottom 0.178: 39.33,19.09 39.13,19.3 | U1.1 30.44,28.49 v31.49,28.49
  Bottom 0.381: v15.71,17.55 16.19,17.07
  Bottom 0.508: C15.2 8.93,24.5 C14.1
  Bottom 0.61: U1.1 28.87,24.67 v28.55,24.34
  Bottom 0.635: 39.13,21.3 v40.13,22.31
  Bottom 0.711: C14.1 9.98,23.61 10.44,23.15
  Bottom 0.889: D2.C 39.33,19.09
  pour POWER: 10.35,23.96 14.6,23.91 15.75,22.8 15.8,20.16 17.65,20.16 20.48,23.42 22.98,23.42 23.36,23.8 26.39,23.8 26.95,24.36 26.95,24.49 27.57,25.11 27.57,39.65 29.45,41.53 40.78,41.53 41.67,40.64 41.67,1.06 41.04,0.42 22.8,0.42 22.3,0.92 22.3,3.19 22.26,3.23 22.26,8.29 23.54,9.57 23.54,12.23 25,13.69 29.3,13.69 30.68,15.07 30.68,21.75 23.48,21.75 19.74,18.01 18.09,18.01 16.9,16.82 14.06,16.82 13.25,17.63 11.3,17.63 9.87,19.06 9.87,23.5 10.33,23.95
  pour Bottom (no thermals): 10.25,23.85 10.83,23.27 11.22,23.27 11.22,22.27 11.25,22.24 10.98,22.24 9.94,23.28 9.94,23.87 10.01,23.94 10.11,23.85
A  (via drill 0.35)
  Top 0.178: J1.1 35.7,11.21 35.3,11.6 35.3,20.63 v33.5,22.43
  Bottom 0.178: U7.6 34.43,26 32.99,26 32.74,25.75 R9.2 32.74,22.77 32.87,22.64 33.29,22.64 v33.5,22.43
AREF
  Top 0.152: C11.1 15.94,31 15.94,29.74 IC1.62
ARST3  (via drill 0.25)
  Top 0.152: v11.23,16.92 11.64,16.51 11.85,16.51 v12.24,16.89
  Bottom 0.076: v11.23,16.92 v11.24,16.93 | v12.24,16.89
  Bottom 0.152: v11.24,16.93 IC3.14 | v12.24,16.89 IC3.12
  Bottom 0.178: R1.1 10.13,17.25 10.79,17.92 IC3.14
B  (via drill 0.35)
  Top 0.178: J1.2 34.68,19.19 v31.43,22.43
  Bottom 0.178: 31.44,23.62 R9.1 | 31.44,23.62 31.44,26.68 32,27.24 34.42,27.24 U7.7 | v31.43,22.43 31.43,23.61 31.44,23.62
COM1  (via drill 0.25)
  Top 0.152: IC1.49 23.33,22.42 v25.02,22.42
  Bottom 0.152: v25.02,22.42 26.16,22.42 FB1.2
COM1_P  (via drill 0.25)
  Top 0.152: J1.3 33.66,16.35 33.66,16.55 28.99,21.23 28.56,21.23 U6.1 28.87,21.99 v28.87,22.39
  Top 0.178: 33.66,16.35 33.66,16.54
  Bottom 0.127: 28.82,22.44 v28.87,22.39
  Bottom 0.152: FB1.1 28.82,22.44
COM2  (via drill 0.25)
  Top 0.152: 3.21,18.48 IC1.18 3.21,18.14 v2.22,18.14
  POWER 0.15: 19.97,14.62 20.87,15.52 | v25.39,18.01 25.39,17.81 25.05,17.47
  POWER 0.152: 19.97,14.62 19.97,9.29 19.31,8.63 18.79,8.63 18.71,8.63 17.34,8.63 11.68,14.29 5.78,14.29 5.37,13.89 1.96,13.89 1.15,14.7 1.15,15.81 1.67,16.33 1.67,17.59 v2.22,18.14 | 20.87,16.97 20.87,17 | 25.05,17.47 21.37,17.47 20.87,16.97 | 20.87,15.52 20.87,16.97
  Bottom 0.152: v25.39,18.01 25.39,18.71 24.91,19.19 FB2.2
COM2_P  (via drill 0.25)
  Top 0.127: v25.5,21.28
  Top 0.152: v25.5,21.28 25.68,21.46 U6.3 | J1.4 32.65,16.17
  Top 0.178: 32.65,16.17 28.5,20.32 25.9,20.32 25.5,20.72 v25.5,21.28
  Bottom 0.152: FB2.1 25.43,21.35 25.52,21.35 25.5,21.33 v25.5,21.28
COM3  (via drill 0.25)
  Top 0.152: FB3.2 25.96,15.53 v25.34,15.53 | v11,31.73 10.7,31.43 10.7,31.06 11.47,30.29 IC1.1
  POWER 0.152: v18.77,27.96 15,31.73 v11,31.73
  Bottom 0.152: v25.34,15.53 24.56,15.53 24.24,15.85 24.24,17.4 23.2,18.43 19.6,22.04 19.6,23.5 20.47,24.37 20.94,24.84 20.94,26.41 20.84,26.5 20.23,26.5 v18.77,27.96
COM3_P  (via drill 0.25)
  Top 0.152: U6.4 FB3.1 25.61,17.3 25.38,17.07 v25.38,16.4
  Top 0.178: 26.39,19.02 U6.4
  Bottom 0.152: J1.8 28.58,9.05 29.69,10.15 29.69,13.63 29.19,14.13 28.19,14.13 27.73,14.6 27.73,15.16 26.49,16.4 v25.38,16.4
D_N
  Top 0.15: 18.05,11.55 19.94,11.55 20.41,11.08
  Top 0.152: 16.65,7.64 16.65,7.01 17.13,6.54 U$5.P$2 | R6.1 17.35,7.64 16.65,7.64 | 18.05,11.55 16.66,10.16 16.66,7.64 16.65,7.64 | 20.41,11.08 U5.1
D_P
  Top 0.15: R7.1 18.88,7.75 19.05,7.58 | 22.31,9.43 U5.3
  Top 0.152: U$5.P$3 17.78,6.36 17.85,6.43 18.16,6.43 18.25,6.52 18.25,7.12 18.88,7.75 | 19.05,7.58 19.94,7.58 20.11,7.75 20.11,8.1 21.11,9.11 21.98,9.11 22.31,9.43
DE  (via drill 0.35)
  Top 0.152: v9.23,10.75 9.23,11.72 IC1.29
  Bottom 0.152: 41.22,25.81 41.23,25.82 41.23,25.94 | 41.23,25.94 41.23,26.72 40.69,27.26 39.74,27.26 | 39.74,27.26 U7.2 39.64,27.11 | 1.31,8.97 R5.1 | 1.31,8.97 2.3,8.97 3.14,9.82 3.84,9.82 4.35,10.33 8.81,10.33 v9.23,10.75 | 27.85,0.94 40.69,0.94 41.4,1.66 41.4,4.59 40.91,5.08 39.62,5.08 39.36,5.34 39.21,5.34 38.17,6.39 38.17,10.46 38.72,11.02 40.36,11.02 41.14,11.8 41.22,11.88 41.22,25.93 41.23,25.94 | 39.64,27.11 U7.3 | 39.64,27.11 39.64,27.16 39.74,27.26 | 1.31,8.88 1.31,8.97
  Bottom 0.178: 1.31,8.88 0.72,8.29 0.72,3.8 3.59,0.94 27.85,0.94 27.86,0.95
E-STOP  (via drill 0.25, 0.35)
  Top 0.102: 0.49,31.79 0.49,26.15 0.72,25.91 R3.1
  Top 0.127: IC1.19 3.68,17.92 3.41,17.65 1.19,17.65 0.75,18.09 | 0.75,23.77 1.32,24.33 1.32,25.82 R3.1 | 0.49,31.79 0.91,32.21 1.02,32.32
  Top 0.152: 0.75,18.09 0.75,23.77 | S2.1 27.01,37.99 27.01,41.25 26.76,41.5 10.44,41.5 10.01,41.07 v9.85,41.07 | IC1.61 14.91,27.57 v14.33,27.57 | 1.02,32.32 1.02,32.37 | v1.07,32.37 0.91,32.21
  POWER 0.152: v14.33,27.57 11.72,30.19 11.09,30.19 10.29,30.99 v9.93,30.99
  Bottom 0.152: v9.85,41.07 9.6,40.82 9.6,39.26 9.44,39.1 6.86,39.1 | 6.86,39.1 6.57,39.1 6.2,39.47 6.2,40.85 1.2,40.85 0.72,40.37 0.72,32.71 v1.07,32.37 | v9.93,30.99 8.68,32.24 7.98,32.24 6.86,33.35 6.86,39.1
FOC
  Top 0.152: IC1.13 4.68,23.71 4.4,23.99 4.4,31.45 5.05,32.1 JP1.1
FOC2
  Top 0.152: IC1.12 5.25,24.27 4.97,24.55 4.97,31.59 6.03,32.65 6.03,34.6 5.45,35.18 4,35.18 3.67,35.51 3.67,35.56 JP1.4
GND  (via drill 0.25, 0.35)
  Top 0.152: IC1.22 4.86,15.26 U9.2 2.45,16.35 C9.2 1.78,16.79 v1,16.79 | C20.1 9.94,35.87 R24.1 | IC1.63 15.36,30.29 15.36,30.47 | C16.2 29.65,17.28 C7.1 | v32.11,40.34 32.09,40.32 32.09,39.08 S2.3 | U9.4 2.5,12.33 v2.27,12.1 | C13.2 1.79,29.1 | v20.55,9.46 21.19,9.46 21.36,9.63 U5.2 | 19.88,6.37 19.77,6.25 19.28,6.25 19.08,6.05 U$5.P$5
  Top 0.178: 20.58,9.46 v20.55,9.46 | U9.4 4.11,12.33 C8.2 | 19.88,6.37 20.45,6.37 v21.59,7.5 | v21.59,7.5 | 1.79,29.1 C12.2
  GND 0.178: v20.55,9.46 20.55,9.49
  Bottom 0.152: SJ1.2 39.45,8.57 v38.89,8.01 | U1.4 27.94,35.45 | v2.27,12.1 2.29,12.08 | IC3.3 13.24,20.82 IC3.EXP | 7.84,18.82
  Bottom 0.178: 13.46,20.82 IC3.3
  Bottom 0.254: 13.24,20.82 13.46,20.82
  other vias: 1.06,30.08 8.6,32.91 7.81,35.8 21.66,35.15 40.61,39.99 39.77,40.72 33.22,40.89
  pour GND: 1.15,41.82 40.9,41.77 41.65,41.02 41.65,1.25 40.79,0.39 1.09,0.39 0.28,1.19 0.28,41.71 0.34,41.77
  pour Bottom: 26.83,41.57 26.83,39.84 25.92,38.92 25.17,38.18 22.84,38.18 22.84,24.43 23.22,24.04 23.54,23.73 29.17,23.73 29.99,23.73 29.99,23.73 30.72,24.45 30.72,24.5 31.03,24.8 31.03,26.09 31.03,27.56 33.25,29.78 33.8,30.33 33.8,31.24 34.03,31.47 34.8,31.47 41.33,31.47 41.74,31.89 41.74,40.67 40.67,41.74 28.21,41.74 26.99,41.74 26.83,41.57
  pour Bottom (rank 2): 0.7,41.51 14.35,41.51 15.13,40.73 15.13,38.85 14.92,38.64 14.92,37.87 15.7,37.09 21.01,37.09 22.24,35.86 22.24,23.62 22.91,22.95 32.08,22.95 32.08,22.95 32.06,25.95 32,26.01 32,27.84 34.89,30.63 38.59,30.7 41.38,30.68 41.45,28.85 40.47,28.23 40.49,24.97 40.56,22.95 41.53,21.98 41.53,1.03 41.38,0.88 2.46,0.88 0.32,3.03 0.32,41.17 0.65,41.51 0.72,41.51
  pour Top: 22.32,0.5 2.05,0.5 0.55,3.59 0.47,41.6 1.19,41.6 40.42,41.6 41.38,40.63 41.38,15.83 40.16,14.61 23.58,14.61 23.02,14.05 23.02,7.86 22.6,7.44 22.6,0.77 22.33,0.5
  pour Top: 22.3,0.48 40.91,0.48 41.71,1.28 41.71,13.62 41.19,14.14 23.76,14.14 23.36,13.74 23.36,7.94 22.57,7.15 22.3,6.89 22.3,0.48
N$1
  Bottom 0.152: 31.76,15.51 31.48,15.23
  Bottom 0.178: F1.P$1 31.73,18.96 31.6,18.96
  Bottom 0.61: 30.72,7.66 J1.6 | J1.7 29.6,6.54 J1.6 | 30.68,10.66 30.68,9.48 | 30.68,10.66 30.68,14.43 31.48,15.23 31.66,15.41 | 31.6,18.96 31.6,19.51 | F1.P$1 31.76,15.51 | J1.6 30.68,7.62 30.68,10.66
N$2
  Bottom 0.178: T3.B 7.24,11.93 R22.2
N$3
  Bottom 0.15: 16.43,19.82 17.33,19.82
  Bottom 0.152: C22.2 17.81,18.91 17.68,19.04 17.68,19.47 17.33,19.82
  Bottom 0.178: IC3.5 16.43,19.82
N$6
  Bottom 0.178: U11.WIPER 5.75,20.64 6.13,20.26 7.13,20.26 7.57,19.82 IC3.17
N$7
  Bottom 0.15: 16.69,20.21 C22.1
  Bottom 0.152: IC3.4 16.58,20.32 16.58,20.31 16.69,20.21
N$8
  Bottom 0.152: R4.2 36.77,12.33 J1.LED1+
N$9
  Bottom 0.152: 11.68,22.78 IC3.23 11.74,23.3 10.75,24.29 R12.1
N$10
  Bottom 0.152: IC3.27 13.74,23.35 14.12,23.73 15.14,23.73 15.29,23.88 15.29,24.72
  Bottom 0.178: 13.76,22.74 IC3.27 | 15.29,24.72 R13.1
N$11
  Bottom 0.152: J1.SHIELD@0 40.34,6.74 SJ1.1
N$12
  Bottom 0.152: SJ2.1 22.56,5.22 J1.SHEILD@1
N$13
  Bottom 0.15: T3.C 11.13,8.68 12.36,8.68 12.6,8.44 | 12.6,8.44 R23.2 | 12.6,9.01 12.6,8.44
  Bottom 0.152: 13.59,10 12.6,9.01
  Bottom 0.178: Q1.G 13.59,10
N$14
  Bottom 0.15: 25.28,10.74 R8.1 25.28,10.74 | 25.28,10.74 J1.LED2+
N$16
  Bottom 0.152: 4.75,17.55 5.69,16.61 R2.1
  Bottom 0.178: 4.72,18.79 U11.3 4.75,17.55
PB4  (via drill 0.35)
  Top 0.152: IC1.14 11.11,15.72 13.91,15.72 14.06,15.57 | 14.06,15.57 14.23,15.4 | v16.17,15.39 14.25,15.39 14.06,15.57
  Bottom 0.152: R8.2 22.61,9.31 16.54,15.39 v16.17,15.39
PC0  (via drill 0.25)
  Top 0.15: IC1.35 15.71,11.13 15.71,10.22 15,9.51 | 12.53,13.31 v8.06,17.78
  Top 0.152: 15,9.51 12.73,9.51 12.53,9.71 12.53,13.31
  POWER 0.15: v9.04,20.81 8.06,19.83 v8.06,17.78
  Bottom 0.15: v9.04,20.81 v9.05,20.82 IC3.19
PC1  (via drill 0.35)
  Top 0.15: v16.94,11.79 16.83,11.68 16.29,11.68
  Top 0.152: IC1.36 16.29,11.68
  Bottom 0.152: IC3.9 13.74,15.05 14.09,14.7 14.09,14.56 14.63,14.02 15.58,14.02 16.94,12.66 v16.94,11.79
PC2  (via drill 0.35)
  Top 0.152: v14.78,13.29 15.81,13.29 IC1.37
  Bottom 0.152: 13.26,17.9 IC3.10 13.24,14.83 v14.78,13.29
PC3  (via drill 0.35)
  Top 0.152: v13.87,13.4 14.1,13.4 14.55,13.85 15.76,13.85 15.9,13.99 16.25,13.99 IC1.38
  Bottom 0.127: IC3.11 12.74,14.52
  Bottom 0.152: 12.74,14.52 v13.87,13.4
PE0  (via drill 0.35)
  Top 0.152: 14.01,10.61 IC1.33 | 14.01,10.61 14.01,10.98 | 14.01,10.61 13.08,11.55 13.08,15.05 13.45,15.42 13.79,15.42 14.36,14.85 15.42,14.85 15.76,14.5 16.41,14.5 17.08,15.17 17.08,15.63 16.43,16.28 16.43,18.24 | 16.43,18.24 16.41,18.26 | v16.41,20.97 16.43,20.95 16.43,18.24
  Bottom 0.152: IC3.2 16.06,21.32 v16.41,20.97
PE3
  Top 0.152: U5.4 22.88,12.64 23.08,12.44 23.08,8.78 22.53,8.23 21.27,8.23 19.97,6.93 19.78,6.93 19.49,6.64 19.39,6.64 19.38,6.62 18.88,6.62 18.43,6.17 U$5.P$4 | 22.32,12.66 22.32,14.08 22.88,14.64 23.81,14.64 24.36,15.19 24.36,18.6 22.66,20.3 21.02,20.3 | 20.99,20.3 16.99,24.3 8.12,24.3 6.94,25.48
  Top 0.178: U5.4 22.32,12.66 | 20.99,20.3 21.02,20.3 21.05,20.33 | 6.94,25.48 IC1.9
PE7  (via drill 0.35)
  Top 0.178: IC1.2 10.9,29.54 9.97,30.47 v8.78,30.47
  Bottom 0.15: 2.53,23.04 7.61,28.12 7.61,29.29 8.2,29.88 8.37,30.05
  Bottom 0.152: v8.78,30.47 v8.78,30.46 8.2,29.88 7.61,29.29
  Bottom 0.178: R22.1 7.13,13.3 6.09,13.3 4.5,14.9 4.5,17.11 2.53,19.08 2.53,23.04
PF2
  Top 0.127: 17.52,28.3 17.52,29.01
  Top 0.152: IC1.59 16.86,27.25 17.52,27.91 17.52,28.3 17.52,29.9 R25.1 | 11.24,37.22 R24.2 | 11.24,37.22 11.24,35.87 C20.2 12.66,35.79 16.54,31.92 16.54,29.99 17.52,29.01 | 11.22,37.24 11.24,37.22
PF5  (via drill 0.35)
  Top 0.152: v9.12,19.07 8.56,19.07 8.47,19.17 8.47,22.39 9.85,23.77 16.64,23.77 17.74,22.66 v17.83,22.66 | v20.17,25.95 19.8,26.32 19.3,26.32 IC1.56
  Bottom 0.152: IC3.16 9.37,19.32 v9.12,19.07 | v17.83,22.66 18.33,22.66 20.17,24.5 v20.17,25.95
ROSC3
  Bottom 0.127: IC3.13 11.74,15.78
  Bottom 0.152: 11.74,15.78 11.74,15.5 R14.2
RST  (via drill 0.25)
  Top 0.127: v3.7,16.72 4.05,16.72 IC1.20
  Bottom 0.127: R17.2 1.24,17.39 1.62,17.02 3.41,17.02 v3.7,16.72
  Bottom 0.152: 2.67,31.65 2.62,31.61 | 2.67,31.65 3.84,32.83 3.84,38.54 4.57,39.27 JP1.5 | R17.2 1.88,21.31 2.11,21.54 2.11,23.43 2.87,24.19 2.87,26.82 4.19,28.14 4.19,28.87 3.54,29.51 3.52,29.51 2.67,30.37 2.67,31.65
RXA  (via drill 0.25, 0.35)
  Top 0.15: 3.36,25.27 3.36,26.6 v3.45,26.68
  Top 0.152: 8.11,10.66 8.11,12.86 IC1.27 9.27,14.02 9.27,15.76 4.75,20.27 1.55,20.27 1.38,20.44 1.38,23.29 3.36,25.27 3.39,25.3 | v7.18,31.38 7.18,32.52 8.73,34.07 8.73,39.76 9.25,40.28 12.91,40.28 17.76,35.43 20.31,35.43 21.98,33.76 30.32,33.76 30.4,33.68 31.94,32.14 33.71,32.14 34.49,31.36 39.94,31.36 40.25,31.04 v40.39,31.04
  Bottom 0.15: U7.1 40.05,28.53 | 7.18,31.3 v7.18,31.38
  Bottom 0.152: v3.45,26.68 5.32,28.56 5.32,29.84 5.95,30.47 6.58,30.47 7.18,31.06 7.18,31.3 | 40.05,28.53 40.39,28.87 v40.39,31.04
SHT
  Top 0.152: IC1.11 5.81,24.84 5.53,25.12 5.53,31.33 6.31,32.11 6.31,32.4 7.02,33.11 7.02,34.75 JP1.3
TXA  (via drill 0.35)
  Top 0.152: v10.54,6.88 9.91,7.52 9.91,8.1 8.67,9.33 8.67,12.29 IC1.28
  Bottom 0.152: v10.54,6.88 12.93,4.5 12.93,3.74 13.22,3.45 21.07,3.45 21.66,4.04 21.66,6.59 23.29,8.23 24.8,8.23 28.75,4.29 36.15,4.29 37.72,5.86 37.72,8.14 | 37.72,8.14 37.74,8.16 | 37.72,8.14 37.72,10.7 38.46,11.44 40.35,11.44 40.83,11.92 40.83,23.52 U7.4
UCAP
  Top 0.152: C10.2 6.55,28.2 IC1.7
USB_N  (via drill 0.25)
  Top 0.152: IC1.4 9.79,28.38 v10.61,27.55 | v16.76,21.69 17.72,20.73 v17.72,16.3 | v17.58,10.27 17.51,10.21 R6.2
  POWER 0.15: v16.76,21.69 16.73,21.66
  POWER 0.152: v17.72,16.3 17.58,16.16 v17.58,10.27 | 16.73,21.66 16.73,23.05 12.22,27.55 v10.61,27.55
USB_P  (via drill 0.25)
  Top 0.152: v8.83,29.25 8.83,28.19 IC1.5 | v18.45,16.95 18.45,20.99 v17.61,21.83 | v18.92,10.29 R7.2
  POWER 0.15: v8.83,29.25 10.05,29.25 10.61,28.7 | 17.52,22.19 17.27,22.44
  POWER 0.152: v18.92,10.29 18.92,16.48 v18.45,16.95 | 10.61,28.7 11.64,28.7 17.13,23.21 17.13,22.58 17.27,22.44 | 17.52,22.19 17.52,21.92 v17.61,21.83
  Bottom 0.15: v17.61,21.83 v17.6,21.83
VCP_3
  Bottom 0.178: IC3.6 15.25,19.21 15.82,19.21 15.96,19.07 C21.1
VREG3
  Bottom 0.178: IC3.8 14.91,17.26 C17.1
XTAL1
  Top 0.178: C9.1 2.23,14.49 U9.3 3.36,13.95 6.43,10.88 6.72,10.88 7.69,11.85 7.69,12.75 6.28,14.16 6.28,14.48 6.89,15.09 IC1.24
XTAL2
  Top 0.178: C8.1 5.17,13.11 U9.1 5.7,14.16 5.7,14.98 IC1.23